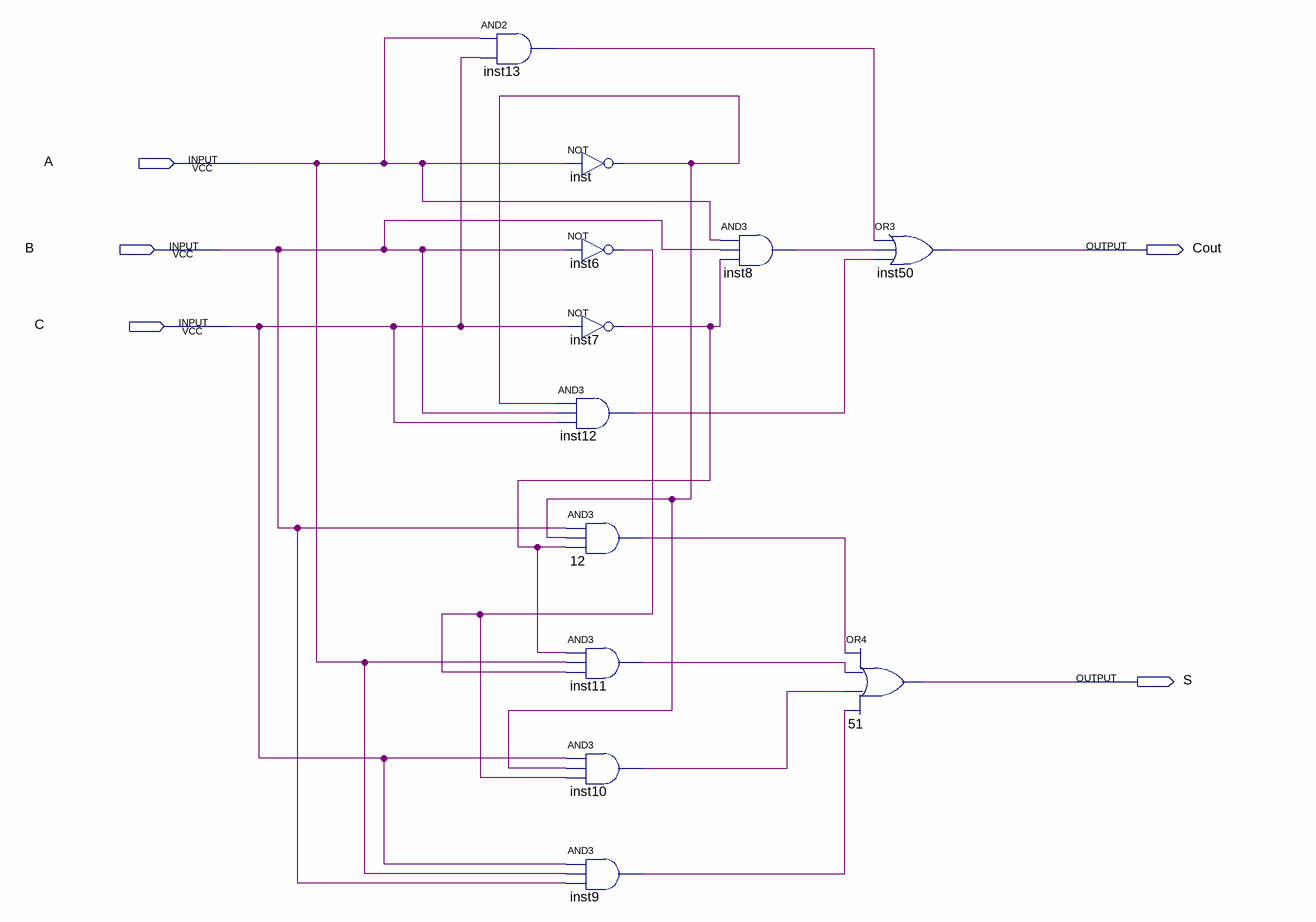
[diagram p0: schematic sheet]
// Quartus schematic lab3.bdf as structural Verilog: 12 symbols, 5 pins
module lab3 (
  input  A,
  input  B,
  input  C,
  output Cout,
  output S
);

  wire inst6_out, inst7_out, inst8_out, inst9_out, inst10_out, inst11_out, inst12_out, inst13_out, inst_out,
       n12_out;

  and inst13 (inst13_out, A, C);
  and inst12 (inst12_out, inst_out, B, C);
  not inst (inst_out, A);
  not inst6 (inst6_out, B);
  not inst7 (inst7_out, C);
  and u_12 (n12_out, B, inst_out, inst7_out);
  and inst11 (inst11_out, inst7_out, A, inst6_out);
  and inst10 (inst10_out, C, inst_out, inst6_out);
  and inst9 (inst9_out, C, A, B);
  and inst8 (inst8_out, A, B, inst7_out);
  or u_51 (S, n12_out, inst11_out, inst10_out, inst9_out);
  or inst50 (Cout, inst13_out, inst8_out, inst12_out);
endmodule
